# Altium schematic sheet Sensores boia.SchDoc: Sensores boia
size A4; Date: 22/04/2023; ApprovedBy: Douglas Felipe; Author: Douglas Felipe; DocumentNumber: GERABS01; Revision: 1.0; SheetNumber: 2; SheetTotal: 4
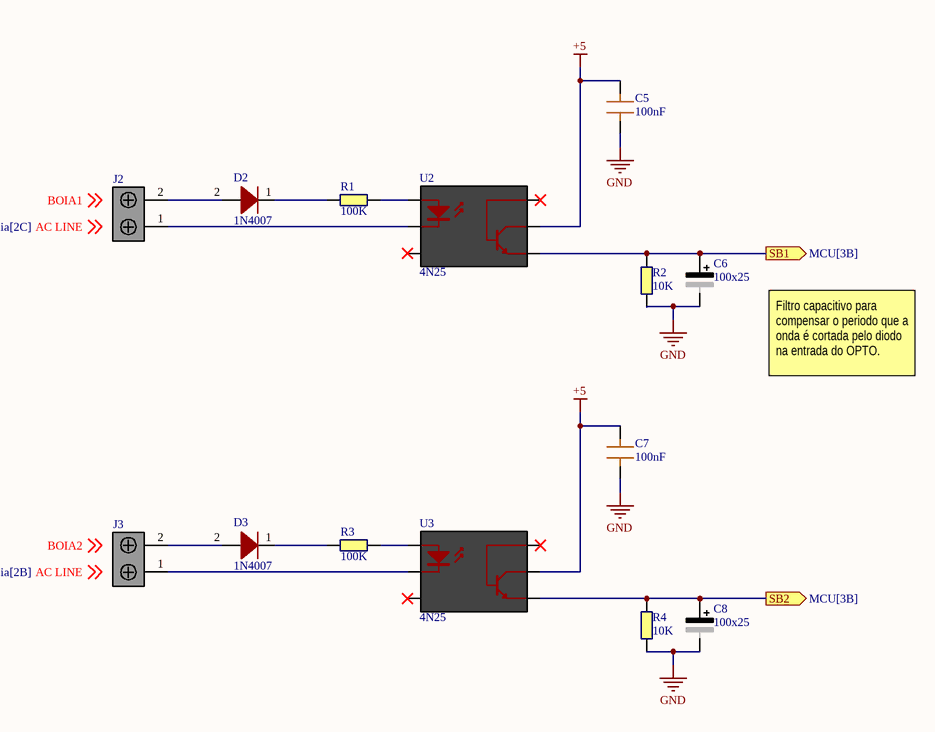
[diagram p0: Sensores boia.SchDoc]

## Parts
C5  100nF  [Capacitor 0805]
C6  100x25  [CAP 100X25 SMD]
C7  100nF  [Capacitor 0805]
C8  100x25  [CAP 100X25 SMD]
D2  1N4007  [SOD123]
D3  1N4007  [SOD123]
J2  Conector 2v Phoenix  [Terminal block 5mm 2V]  (value not drawn)
J3  Conector 2v Phoenix  [Terminal block 5mm 2V]  (value not drawn)
R1  100K  [RESISTOR 1W 2512]
R2  10K  [RESISTOR 1/4W 0805]
R3  100K  [RESISTOR 1W 2512]
R4  10K  [RESISTOR 1/4W 0805]
U2  4N25  [4N25]
U3  4N25  [4N25]

## Ports
SB1 (out, see MCU[3B]), SB2 (out, see MCU[3B])

## Nets
+5: C5.2 C7.2 U2.5(C) U3.5(C)
GND: C5.1 C6.2(-) C7.1 C8.2(-) R2.1 R4.1
SB1: C6.1(+) R2.2 U2.6(B) ; port SB1
SB2: C8.1(+) R4.2 U3.6(B) ; port SB2
NetD2_1: D2.1 R1.1
NetD2_2: D2.2 J2.2
NetD3_1: D3.1 R3.1
NetD3_2: D3.2 J3.2
NetJ2_1: J2.1 U2.2(K)
NetJ3_1: J3.1 U3.2(K)
NetR1_2: R1.2 U2.1(A)
NetR3_2: R3.2 U3.1(A)

Not connected (* = marked no-connect by the designer): U2 3(NC)*; U3 3(NC)*

## Notes on the sheet
- Filtro capacitivo para compensar o periodo que a onda é cortada pelo diodo na entrada do OPTO.
- Labels drawn without touching a wire or pin: AC LINE, BOIA1, BOIA2
- PROJETO
- REV
- TITULO
- PÁG
- DE
- NÚMERO
- DESIGNER
- REVISADO POR
- DATA
- ARQUIVO
- TAMANHO
- A4

## Library data of the parts
C5 C7 = CAPACITOR: Published: 8-Jun-2000; LatestRevisionDate: 17-Jul-2002; LatestRevisionNote: Re-released for DXP Platform.; PackageReference: RAD-0.3; Publisher: Altium Limited; PackageDescription: Radial Cap, Thru-Hole; 2 Leads; 0.3 in Pin Spacing
C6 C8 = CAPACITOR ELETROLITICO: Polarized Capacitor (Radial); Published: 8-Jun-2000; LatestRevisionDate: 17-Jul-2002; LatestRevisionNote: Re-released for DXP Platform.; PackageReference: RB7.6-15; Publisher: Altium Limited; PackageDescription: Polarized Capacitor (Radial); 2 Leads
D2 D3 = DIODO 1N4007: Diodo retificador de uso geral.; Published: 8-Jun-2000; LatestRevisionDate: 17-Jul-2002; LatestRevisionNote: Re-released for DXP Platform.; DatasheetVersion: 1997; PackageReference: DO-35; Publisher: Altium Limited; PackageDescription: Diode, Axial; Body 3.8 x 1.9 mm (LxDia. max), Lead Dia. 0.53 mm (max); Code_JEDEC: DO-204-AH; ComponentLink1Description: Manufacturer Link; ComponentLink1URL: http://www.fairchildsemi.com/; ComponentLink2Description: Datasheet; ComponentLink2URL: http://www.fairchildsemi.com/ds/1N%2F1N4148.pdf
J2 J3 = TERMINAL BLOCK 2V: Block, Terminal; 6 A; 63 V; 5 mm; 26 to 20 AWG; 2; Screw; Soldering; 1.5 kV; Manufacturer: Phoenix Contact; Manufacturer Part Number: 1725656; Current Rating: 6A; Voltage Rating: 125V; Number of Positions: 2; Number of Levels: 1; Connector Type: Screw,PCB,Terminal Block; Max Supply Voltage: 63V; Pitch: 2.54mm; Wire Gauge (Max): 26AWG; Wire Gauge (Min): 20AWG; Stripping Length: 4.5mm; Approvals: UL,CSA,cULus,EAC; RoHS: Yes; Category: Terminal Blocks; Stock 1: 29866; Pricing 1: 1=1,94000, 10=1,76000, 50=1,69000, 100=1,64000, 1000=1,27000, 10000=1,17000 (USD); Mount: Through Hole; Number of Pins: 2; Contact Material: Tin; Weight: 0.022575oz; Housing Material: Polyamide; Color: Green; Housing Color: Green; Insulation Material: Nylon; Package Quantity: 50; Packaging: Bulk; Termination: Solder; Series: MPT; Max Current Rating: 6A; Number of Contacts: 2; Number of Rows: 1; Number of Positions Per Level: 2; Current: 6A; Voltage: 125V; Orientation: Straight; Number of Poles: 2; Number of Circuits: 2; Length: 5.54mm; Width: 12mm; Height: 6.2mm; Depth: 6.2mm; Wire/Cable Gauge: 26AWG; Radiation Hardening: No; RoHS Compliant: Yes; Lead Free: Lead Free; Flammability Rating: UL94 V-0; Reach SVHC Compliant: Yes; ComponentLink1URL: https://datasheet.ciiva.com/16071/1725656-16071846.pdf?src-supplier=Onlinecomponents.com; ComponentLink1Description: https://datasheet.ciiva.com/16071/1725656-16071846.pdf?src-supplier=Onlinecomponents.com; ComponentLink2URL: https://datasheet.ciiva.com/15169/getdatasheetpartid-199323-15169849.pdf?src-supplier=Verical; ComponentLink2Description: https://datasheet.ciiva.com/15169/getdatasheetpartid-199323-15169849.pdf?src-supplier=Verical; ComponentLink3URL: https://datasheet.ciiva.com/823/1725656-823793.pdf?src-supplier=Digi-Key; ComponentLink3Description: https://datasheet.ciiva.com/823/1725656-823793.pdf?src-supplier=Digi-Key; ComponentLink4URL: https://datasheet.ciiva.com/1120/319957-1120510.pdf?src-supplier=Farnell; ComponentLink4Description: https://datasheet.ciiva.com/1120/319957-1120510.pdf?src-supplier=Farnell; ComponentLink5URL: https://datasheet.ciiva.com/26340/788052-da-01-en-100ntklemme-1725656-250-st-26340907.pdf?src-supplier=Conrad; ComponentLink5Description: https://datasheet.ciiva.com/26340/788052-da-01-en-100ntklemme-1725656-250-st-26340907.pdf?src-supplier=Conrad; Supplier Part Number 1: 651-1725656
R1 R3 = RESISTOR 1W: Resistor; Published: 8-Jun-2000; LatestRevisionDate: 17-Jul-2002; LatestRevisionNote: Re-released for DXP Platform.; PackageReference: AXIAL-0.4; Publisher: Altium Limited; PackageDescription: Axial Device, Thru-Hole; 2 Leads; 0.4 in Pin Spacing
R2 R4 = RESISTOR 1/4W: Resistor; Published: 8-Jun-2000; LatestRevisionDate: 17-Jul-2002; LatestRevisionNote: Re-released for DXP Platform.; PackageReference: AXIAL-0.4; Publisher: Altium Limited; PackageDescription: Axial Device, Thru-Hole; 2 Leads; 0.4 in Pin Spacing